# Altium schematic sheet SparkFun_STUSB4500_USB-PD.SchDoc: SparkFun_STUSB4500_USB-PD
size 270 x 224 mm; Origin: Eagle; Date: 12/02/2020 16:45:17; SheetNumber: 1; DESIGNER: DESIGNER; REV: REV; GateName_1: G$1; SymbolName_1: FRAME-LETTER; LibraryName: SparkFun-Aesthetics; DeviceSetName: FRAME-LETTER; GateName_2: V; SymbolName_2: DOCFIELD; Sheet: Sheet:; ReleasedundertheCreativeCommons: Released under the Creative Commons; AttributionShare-Alike4.0License: Attribution Share-Alike 4.0 License; https://creativecommons.org/licenses/by-sa/4.0/: https://creativecommons.org/licenses/by-sa/4.0/; Designby: Design by:
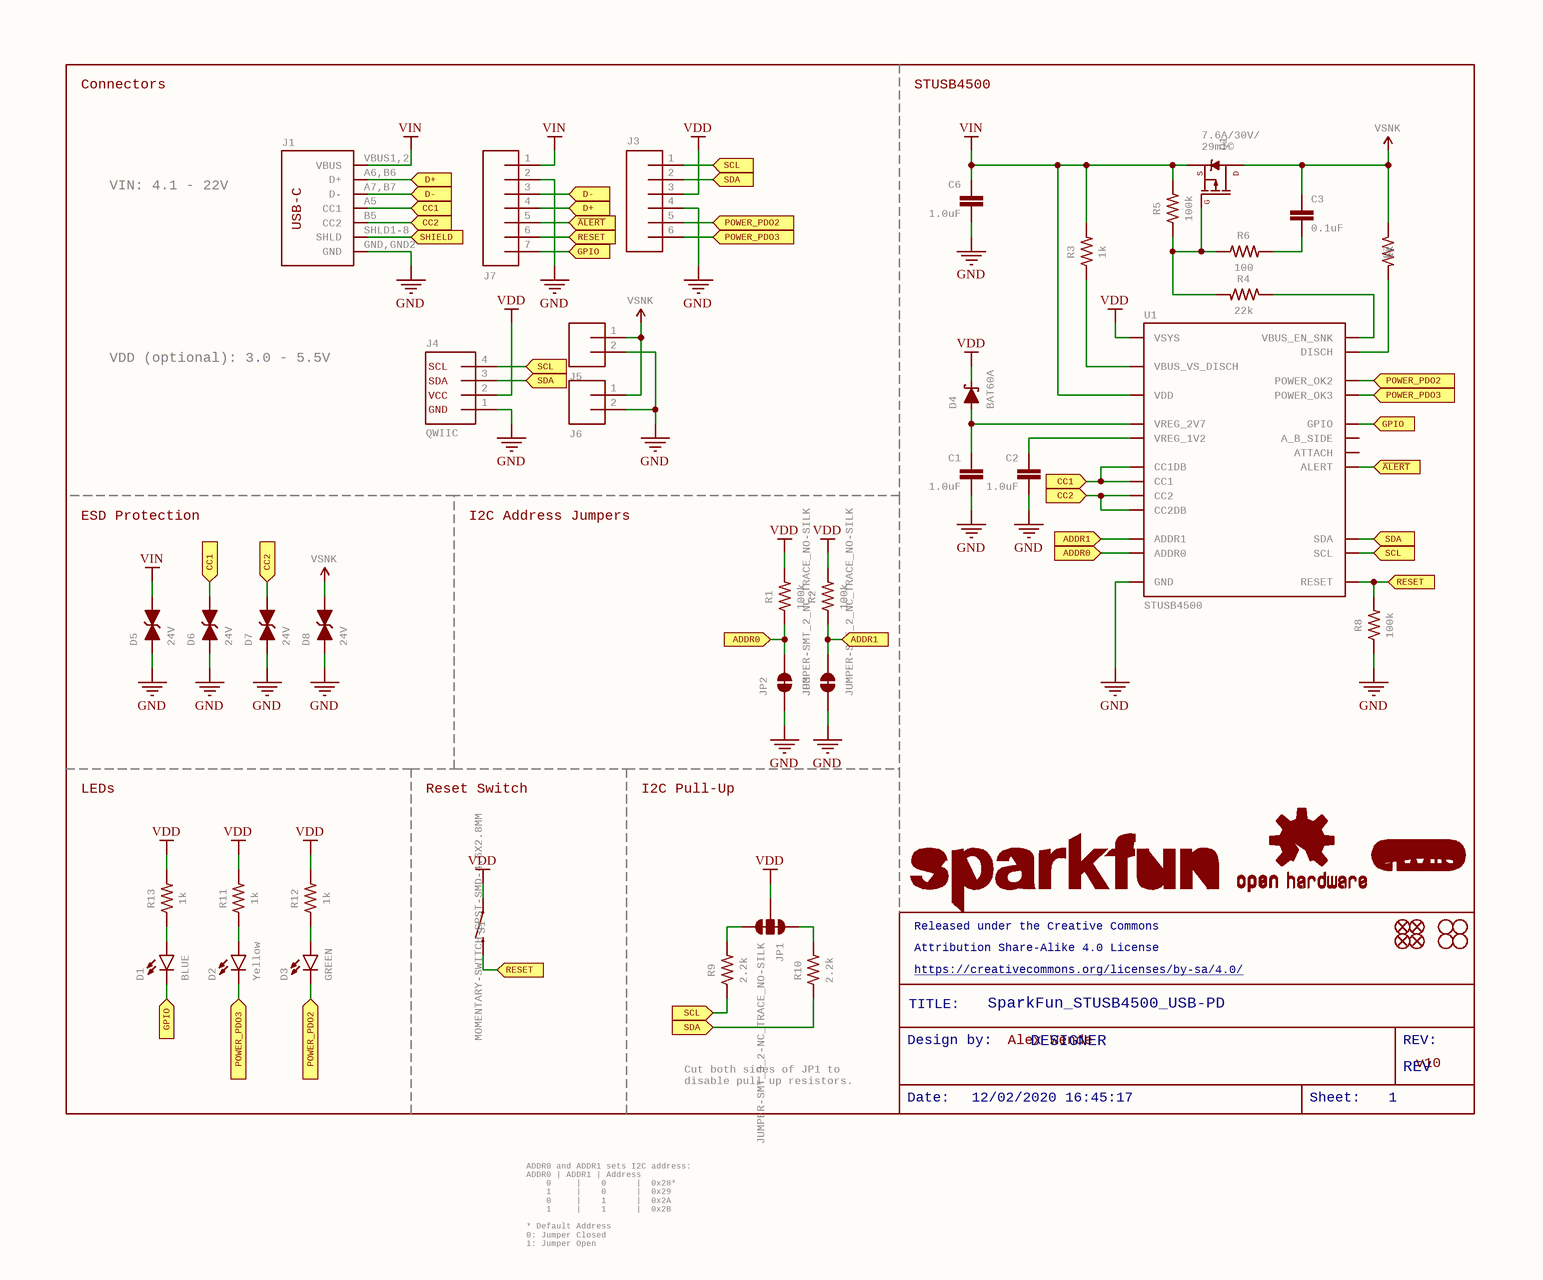
[diagram p0: SparkFun_STUSB4500_USB-PD.SchDoc]

## Parts
C1  1.0uF  [0603]
C2  1.0uF  [0603]
C3  0.1uF  [0603]
C6  1.0uF  [0603]
D1  BLUE  [LED-0603]
D2  Yellow  [LED-0603]
D3  GREEN  [LED-0603]
D4  BAT60A  [SOD-323]
D5  24V  [0603]
D6  24V  [0603]
D7  24V  [0603]
D8  24V  [0603]
FD1  FIDUCIALUFIDUCIAL  [FIDUCIAL-MICRO]  (value not drawn)
FD2  FIDUCIALUFIDUCIAL  [FIDUCIAL-MICRO]  (value not drawn)
FD3  FIDUCIALUFIDUCIAL  [FIDUCIAL-MICRO]  (value not drawn)
FD4  FIDUCIALUFIDUCIAL  [FIDUCIAL-MICRO]  (value not drawn)
H1  STAND-OFF  [STAND-OFF]  (value not drawn)
H2  STAND-OFF  [STAND-OFF]  (value not drawn)
H3  STAND-OFF  [STAND-OFF]  (value not drawn)
H4  STAND-OFF  [STAND-OFF]  (value not drawn)
J1  USB_C2-LAYER  [USB-C-16P]  (value not drawn)
J3  CONN_06NO_SILK_NO_POP  [1X06_NO_SILK]  (value not drawn)
J4  QWIIC  [JST04_1MM_RA]
J5  CONN_023.5MM  [SCREWTERMINAL-3.5MM-2]  (value not drawn)
J6  CONN_021X02_NO_SILK  [1X02_NO_SILK]  (value not drawn)
J7  CONN_07NO_SILK  [1X07_NO_SILK]  (value not drawn)
JP1  JUMPER-SMT_3_2-NC_TRACE_NO-SILK  [SMT-JUMPER_3_2-NC_TRACE_NO-SILK]
JP2  JUMPER-SMT_2_NC_TRACE_NO-SILK  [SMT-JUMPER_2_NC_TRACE_NO-SILK]
JP3  JUMPER-SMT_2_NC_TRACE_NO-SILK  [SMT-JUMPER_2_NC_TRACE_NO-SILK]
LOGO1  OSHW-LOGOS  [OSHW-LOGO-S]  (value not drawn)
LOGO2  SFE_LOGO_NAME.1_INCH  [SFE_LOGO_NAME_.1]  (value not drawn)
LOGO3  QWIIC_LOGO_5MM  [QWIIC_5MM]  (value not drawn)
Q1  9A/30V/15mΩ  [8-POWERVDFN-3X3]  (value not drawn)
R1  100k  [0603]
R2  100k  [0603]
R3  1k  [0603]
R4  22k  [0603]
R5  100k  [0603]
R6  100  [0603]
R7  1k  [0603]
R8  100k  [0603]
R9  2.2k  [0603]
R10  2.2k  [0603]
R11  1k  [0603]
R12  1k  [0603]
R13  1k  [0603]
S1  MOMENTARY-SWITCH-SPST-SMD-4.6X2.8MM  [TACTILE_SWITCH_SMD_4.6X2.8MM]
SUPPLY3  VSNK
SUPPLY4  VSNK
SUPPLY10  VSNK
U1  STUSB4500  [QFN-24]

## Ports
ADDR0 (in), ADDR1 (in), CC1 (in), CC2 (in), D+ (in), D- (in), GPIO (in), POWER_PDO2 (in), POWER_PDO3 (in), RESET (in), SCL (in), SDA (in), SHIELD (in), ~{ALERT} (in)

## Nets
GND: C1.2 C2.2 C6.2 D5.1(A) D6.1(A) D7.1(A) D8.1(A) J1.GND,GND2(GND) J3.4 J4.1 J5.2 J6.2 J7.2 JP2.1 JP3.1 R8.1 U1.P$10,25(GND)
VDD: D4.C J3.3 J4.2 JP1.2 R1.2 R2.2 R11.2 R12.2 R13.2 S1.1,2 U1.P$22(VSYS)
VIN: C6.1 D5.2(C) J1.VBUS1,2(VBUS) J7.1 Q1.1-3(S) R3.2 R5.2 U1.P$24(VDD)
~{ALERT}: J7.5 U1.P$19(ALERT) ; port ~{ALERT}
ADDR0: JP2.2 R1.1 U1.P$12(ADDR0) ; port ADDR0
ADDR1: JP3.2 R2.1 U1.P$13(ADDR1) ; port ADDR1
CC1: D6.2(C) J1.A5(CC1) U1.P$1(CC1DB) U1.P$2(CC1) ; port CC1
CC2: D7.2(C) J1.B5(CC2) U1.P$4(CC2) U1.P$5(CC2DB) ; port CC2
D+: J1.A6,B6(D+) J7.4 ; port D+
D-: J1.A7,B7(D-) J7.3 ; port D-
GPIO: D1.C J7.7 U1.P$15(GPIO) ; port GPIO
POWER_PDO2: D3.C J3.5 U1.P$20(POWER_OK2) ; port POWER_PDO2
POWER_PDO3: D2.C J3.6 U1.P$14(POWER_OK3) ; port POWER_PDO3
RESET: J7.6 R8.2 S1.3,4 U1.P$6(RESET) ; port RESET
SCL: J3.1 J4.4 R9.1 U1.P$7(SCL) ; port SCL
SDA: J3.2 J4.3 R10.1 U1.P$8(SDA) ; port SDA
SHIELD: J1.SHLD1-8(SHLD) ; port SHIELD
NetC1_1: C1.1 D4.A U1.P$23(VREG_2V7)
NetC2_1: C2.1 U1.P$21(VREG_1V2)
NetC3_1: C3.1 Q1.551-53(D) R7.1 SUPPLY4.?1(VOUT)
NetC3_2: C3.2 R6.2
NetD1_A: D1.A R13.1
NetD2_A: D2.A R11.1
NetD3_A: D3.A R12.1
NetD8_2: D8.2(C) SUPPLY3.?1(VOUT)
NetJ5_1: J5.1 J6.1 SUPPLY10.?1(VOUT)
NetJP1_1: JP1.1 R10.2
NetJP1_3: JP1.3 R9.2
NetQ1_4: Q1.4(G) R4.2 R5.1 R6.1
NetR3_1: R3.1 U1.P$18(VBUS_VS_DISCH)
NetR4_1: R4.1 U1.P$16(VBUS_EN_SNK)
NetR7_2: R7.2 U1.P$9(DISCH)

Not connected (* = marked no-connect by the designer): U1 P$11(ATTACH) P$17(A_B_SIDE)

## Notes on the sheet
- Connectors
- STUSB4500
- (near Q1) 7.6A/30V/
  29mÎ©
- VIN: 4.1 - 22V
- VDD (optional): 3.0 - 5.5V
- ESD Protection
- I2C Address Jumpers
- LEDs
- Reset Switch
- I2C Pull-Up
- (near LOGO2) Released under the Creative Commons
- TITLE:
- (near LOGO2) Attribution Share-Alike 4.0 License
- (near LOGO2) https://creativecommons.org/licenses/by-sa/4.0/
- SparkFun_STUSB4500_USB-PD
- Cut both sides of JP1 to
  disable pull up resistors.
- Design by:
- Alex Wende
- DESIGNER
- REV:
- REV
- v10
- Date:
- 12/02/2020 16:45:17
- Sheet:
- 1
- ADDR0 and ADDR1 sets I2C address:
  ADDR0 | ADDR1 | Address
  0     |    0      |  0x28*
  1     |    0      |  0x29
  0     |    1      |  0x2A
  1     |    1      |  0x2B
  * Default Address
  0: Jumper Closed
  1: Jumper Open

## Library data of the parts
C1 C2 C6 = 1.0UF-0603-16V-10%: 1ÂµF ceramic capacitors    A capacitor is a passive two-terminal electrical component used to store electrical energy temporarily in an electric field.; GateName_1: G$1; SymbolName_1: CAP; PROD_ID: CAP-00868; DeviceName: -0603-16V-10%; LibraryName: SparkFun-Capacitors; DeviceSetName: 1.0UF
C3 = 0.1UF-0603-100V-10%: 0.1ÂµF ceramic capacitors    A capacitor is a passive two-terminal electrical component used to store electrical energy temporarily in an electric field.; GateName_1: G$1; SymbolName_1: CAP; PROD_ID: CAP-08390; DeviceName: -0603-100V-10%; LibraryName: SparkFun-Capacitors; DeviceSetName: 0.1UF
D1 = LED-BLUE0603: Blue SMD LED    Used in manufacturing of various products at SparkFun   Packages: 0603 - SMD 0603 package [Product Link]  1206 - SMD1206  package [Product Link]    SparkFun Products: ESP8266 Thing-Dev Board  RedBoard; GateName_1: G$1; DeviceName: 0603; PROD_ID: DIO-08575; SymbolName_1: LED; LibraryName: SparkFun-LED; DeviceSetName: LED-BLUE
D2 = LED-YELLOW0603: Yellow SMD LED Used in manufacturing several products at SparkFun.    Packages:  0603 -  SMD 0603  package  0603 -SMART - SMART SMD 0603  package (more efficient/more expensive) [Product Link]   LilyPad - SMD1206  package[Product Datasheet]       SparkFun Products: Blynk Board  IOIO-OTG  XBee Explorer Serial; GateName_1: G$1; DeviceName: 0603; PROD_ID: DIO-09003; SymbolName_1: LED; LibraryName: SparkFun-LED; DeviceSetName: LED-YELLOW
D3 = LED-GREEN0603: Green SMD LED    Used in manufacturing of various products at SparkFun   Packages: 0603 - SMD 0603 package [Product Link]  LilyPad 1206 - SMD1206 LilyPad package [Product Link]   1206 - SMD1206  package   1206 Bottom Mount -SMD 1206 Bottom Mount    SparkFun Products: Pro Mini 328 -5V  RedBoard  MP3 Trigger  Makey Makey; GateName_1: G$1; DeviceName: 0603; PROD_ID: DIO-00821; SymbolName_1: LED; LibraryName: SparkFun-LED; DeviceSetName: LED-GREEN
D4 = DIODE-SCHOTTKY-BAT60A: Schottky diode    A Schottky diode is a semiconductor diode which has a low forward voltage drop and a very fast switching action.; GateName_1: G$1; PROD_ID: DIO-14072; SymbolName_1: DIODE-SCHOTTKY; DeviceName: -BAT60A; LibraryName: SparkFun-DiscreteSemi; DeviceSetName: DIODE-SCHOTTKY
D5-D8 = DIODE_TVS: GateName_1: G$1; SymbolName_1: DIODE-TVS; PROD_ID: DIO-14502; LibraryName: SparkFun-DiscreteSemi; DeviceSetName: DIODE_TVS
FD1-FD4 = FIDUCIALUFIDUCIAL: Fiducial Alignment Points    Point-of-reference for pick-and-place machines and other optical instruments.; GateName_1: G$1; SymbolName_1: FIDUCIAL; DeviceName: UFIDUCIAL; LibraryName: SparkFun-Aesthetics; DeviceSetName: FIDUCIAL
H1-H4 = STAND-OFF: Stand Off    Drill holes for mechanically mounting via screws, standoffs, etc.   Note: Use the keepout ring to avoid running the screw head into surrounding components.  Variant Overviews  STAND-OFF - Mechanical footprint for a #4 phillips button head screw.  STAND-OFF-TIGHT - Mechanical footprint for a #4 phillips button head screw,      Example SparkFun Products  Screw - Phillips Head (1/4", 4-40, 10 pack) (PRT-10453)  Screw - Phillips Head (1/2", 4-40, 10 pack) (PRT-10452)  Screw - Phillips Head (3/4", 4-40, 10 pack) (PRT-10451)  Screw - Phillips Head (1", 4-40, 10 pack) (PRT-10450); GateName_1: G$1; SymbolName_1: STAND-OFF; LibraryName: SparkFun-Hardware; DeviceSetName: STAND-OFF
J1 = USB_C2-LAYER: USB Type C 16Pin Connector Super Speed pins not available on the 16-pin purely SMD connector so this part is best for USB 2.0 implementations. D1 and D2 are tied together enabling D+/- no matter which way the cable is plugged into the connector. The two channel configuration pins (CC1/2) are exposed. These are normally connected to ground via 5.1k resistors but can be reconfigured for high current/high power applications.; GateName_1: J1; SymbolName_1: USB-C-MINIMUM; DeviceSetName: USB_C; PROD_ID: CONN-14122; DeviceName: 2-LAYER; LibraryName: SparkFun-Connectors; USB-C: USB-C
J3 = CONN_06NO_SILK_NO_POP: Multi connection point. Often used as Generic Header-pin footprint for 0.1 inch spaced/style header connections    On any of the 0.1 inch spaced packages, you can populate with these:  Break Away Headers - Straight (PRT-00116)   Break Away Male Headers - Right Angle (PRT-00553)   Female Headers (PRT-00115)   Break Away Headers - Machine Pin (PRT-00117)   Break Away Female Headers - Swiss Machine Pin (PRT-00743)   Arduino Stackable Header - 6 Pin (PRT-09280)        For SCREWTERMINALS and SPRING TERMINALS visit here:  Screw Terimnals on SparkFun.com (5mm/3.5mm/2.54mm spacing)       This device is also useful as a general connection point to wire up your design to another part of your project. Our various solder wires solder well into these plated through hole pads.  Hook-Up Wire - Assortment (Stranded, 22 AWG) (PRT-11375)   Hook-Up Wire - Assortment (Solid Core, 22 AWG) (PRT-11367)   View the entire wire category on our website here; GateName_1: G$1; SymbolName_1: CONN_06; DeviceName: NO_SILK_NO_POP; LibraryName: SparkFun-Connectors; DeviceSetName: CONN_06
J4 = QWIIC_CONNECTORJS-1MM: SparkFun I2C Standard Qwiic Connector An SMD 1mm pitch JST connector makes it easy and quick (get it? Qwiic?) to connect I2C devices to each other. The Qwiic system enables fast and solderless connection between popular platforms and various sensors and actuators.   We carry 200mm, 100mm, 50mm, and breadboard friendly Qwiic cables. We also offer 10 pcs strips the SMD connectors.; GateName_1: G$1; SymbolName_1: I2C_STANDARD; DeviceName: JS-1MM; PROD_ID: CONN-13694; LibraryName: SparkFun-Connectors; DeviceSetName: QWIIC_CONNECTOR; SDA: SDA; VCC: VCC; GND: GND; SCL: SCL
J5 = CONN_023.5MM: Multi connection point. Often used as Generic Header-pin footprint for 0.1 inch spaced/style header connections    On any of the 0.1 inch spaced packages, you can populate with these:  Break Away Headers - Straight (PRT-00116)   Break Away Male Headers - Right Angle (PRT-00553)   Female Headers (PRT-00115)   Break Away Headers - Machine Pin (PRT-00117)   Break Away Female Headers - Swiss Machine Pin (PRT-00743)        For SCREWTERMINALS and SPRING TERMINALS visit here:  Screw Terimnals on SparkFun.com (5mm/3.5mm/2.54mm spacing)       This device is also useful as a general connection point to wire up your design to another part of your project. Our various solder wires solder well into these plated through hole pads.  Hook-Up Wire - Assortment (Stranded, 22 AWG) (PRT-11375)   Hook-Up Wire - Assortment (Solid Core, 22 AWG) (PRT-11367)   View the entire wire category on our website here          Special notes: Molex polarized connector foot print use with: PRT-08233 with associated crimp pins and housings.  2.54_SCREWTERM for use with  PRT-10571.  3.5mm Screw Terminal footprints for  PRT-08084  5mm Screw Terminal footprints for use with PRT-08432; GateName_1: G$1; PROD_ID: CONN-08399; SymbolName_1: CONN_02; DeviceName: 3.5MM; LibraryName: SparkFun-Connectors; DeviceSetName: CONN_02
J6 = CONN_021X02_NO_SILK: Multi connection point. Often used as Generic Header-pin footprint for 0.1 inch spaced/style header connections    On any of the 0.1 inch spaced packages, you can populate with these:  Break Away Headers - Straight (PRT-00116)   Break Away Male Headers - Right Angle (PRT-00553)   Female Headers (PRT-00115)   Break Away Headers - Machine Pin (PRT-00117)   Break Away Female Headers - Swiss Machine Pin (PRT-00743)        For SCREWTERMINALS and SPRING TERMINALS visit here:  Screw Terimnals on SparkFun.com (5mm/3.5mm/2.54mm spacing)       This device is also useful as a general connection point to wire up your design to another part of your project. Our various solder wires solder well into these plated through hole pads.  Hook-Up Wire - Assortment (Stranded, 22 AWG) (PRT-11375)   Hook-Up Wire - Assortment (Solid Core, 22 AWG) (PRT-11367)   View the entire wire category on our website here          Special notes: Molex polarized connector foot print use with: PRT-08233 with associated crimp pins and housings.  2.54_SCREWTERM for use with  PRT-10571.  3.5mm Screw Terminal footprints for  PRT-08084  5mm Screw Terminal footprints for use with PRT-08432; GateName_1: G$1; SymbolName_1: CONN_02; DeviceName: 1X02_NO_SILK; LibraryName: SparkFun-Connectors; DeviceSetName: CONN_02
J7 = CONN_07NO_SILK: Multi connection point. Often used as Generic Header-pin footprint for 0.1 inch spaced/style header connections    On any of the 0.1 inch spaced packages, you can populate with these:  Break Away Headers - Straight (PRT-00116)   Break Away Male Headers - Right Angle (PRT-00553)   Female Headers (PRT-00115)   Break Away Headers - Machine Pin (PRT-00117)   Break Away Female Headers - Swiss Machine Pin (PRT-00743)        For SCREWTERMINALS and SPRING TERMINALS visit here:  Screw Terimnals on SparkFun.com (5mm/3.5mm/2.54mm spacing)       This device is also useful as a general connection point to wire up your design to another part of your project. Our various solder wires solder well into these plated through hole pads.  Hook-Up Wire - Assortment (Stranded, 22 AWG) (PRT-11375)   Hook-Up Wire - Assortment (Solid Core, 22 AWG) (PRT-11367)   View the entire wire category on our website here          Special notes:     Molex polarized connector foot print use with SKU : PRT-08231 with associated crimp pins and housings. 1MM SMD Version SKU: PRT-10208    NOTES ON THE VARIANTS LOCK and LOCK_LONGPADS... This footprint was designed to help hold the alignment of a through-hole component (i.e.  6-pin header) while soldering it into place. You may notice that each hole has been shifted either up or down by 0.005 of an inch from it's more standard position (which is a perfectly straight line).  This slight alteration caused the pins (the squares in the middle) to touch the edges of the holes.  Because they are alternating, it causes a "brace" to hold the component in place.  0.005 has proven to be the perfect amount of "off-center" position when using our standard breakaway headers. Although looks a little odd when you look at the bare footprint, once you have a header in there, the alteration is very hard to notice.  Also,if you push a header all the way into place, it is covered up entirely on the bottom side.; GateName_1: J1; SymbolName_1: CONN_07; DeviceName: NO_SILK; LibraryName: SparkFun-Connectors; DeviceSetName: CONN_07
JP1 = JUMPER-SMT_3_2-NC_TRACE_NO-SILK: Normally closed trace jumper (2 of 2 connections)    This jumper has a trace between all three pads so they are normally closed (NC). Use a razor knife to open the connection(s). For best results follow the IPC guidelines for cutting traces: Cutout at least 0.063 mm (0.005 in).  Remove all loose material to clean up the cut area.  Seal the cut with an approved epoxy.       Reapply solder to reclose the connection(s).; GateName_1: G$1; SymbolName_1: SMT-JUMPER_3_2-NC_TRACE; DeviceName: _NO-SILK; LibraryName: SparkFun-Jumpers; DeviceSetName: JUMPER-SMT_3_2-NC_TRACE
JP2 JP3 = JUMPER-SMT_2_NC_TRACE_NO-SILK: Normally closed trace jumper    This jumper has a trace between two pads so it's normally closed (NC). Use a razor knife to open the connection. For best results follow the IPC guidelines for cutting traces: Cutout at least 0.063 mm (0.005 in).  Remove all loose material to clean up the cut area.  Seal the cut with an approved epoxy.       Reapply solder to reclose the connection.; GateName_1: G$1; SymbolName_1: SMT-JUMPER_2_NC_TRACE; DeviceName: _NO-SILK; LibraryName: SparkFun-Jumpers; DeviceSetName: JUMPER-SMT_2_NC_TRACE
LOGO1 = OSHW-LOGOS: Open-Source Hardware (OSHW) Logo     This logo indicates the piece of hardware it is found on incorporates a OSHW license and/or adheres to the definition of open source hardware found here: http://freedomdefined.org/OSHW; GateName_1: G$1; DeviceName: S; SymbolName_1: OSHW-LOGO; LibraryName: SparkFun-Aesthetics; DeviceSetName: OSHW-LOGO
LOGO2 = SFE_LOGO_NAME.1_INCH: SparkFun Font Logo    This is the SparkFun name logo. The logo on the schematic will always be the same size; the package variant is the height of the flame part of the logo (or the height the flame would be, if it were drawn). Default layer for the logo on the board is tSilk.; GateName_1: G$1; SymbolName_1: SFE_LOGO_NAME; DeviceName: .1_INCH; LibraryName: SparkFun-Aesthetics; DeviceSetName: SFE_LOGO_NAME
LOGO3 = QWIIC_LOGO_5MM: Qwiic Logos for placement on schematic and PCB. The 5.5mm silk logo is best for placing next to Qwiic connector.; GateName_1: G$1; DeviceName: _5MM; SymbolName_1: LOGO; LibraryName: SparkFun-Aesthetics; DeviceSetName: QWIIC_LOGO
Q1 = MOSFET_PCH-STL9P3LLH6: P-channel MOSFETs    Voltage controlled devices that allow control of high current outputs.   SparkFun Products: SparkFun ESP32 Thing  SparkFun ESP8266 Thing  SparkFun Pi Servo HAT V2 DMG2305UX-7 (20V/4.2A/SOT23-3); GateName_1: G$1; SymbolName_1: LABELED-PMOS; PROD_ID: TRANS-14715; DeviceName: -STL9P3LLH6; LibraryName: SparkFun-DiscreteSemi; DeviceSetName: MOSFET_PCH; D: D; S: S; G: G
R1 R2 R5 R8 = 100KOHM-0603-1/10W-1%: 100kÎ© resistor    A resistor is a passive two-terminal electrical component that implements electrical resistance as a circuit element. Resistors act to reduce current flow, and, at the same time, act to lower voltage levels within circuits. - Wikipedia; GateName_1: G$1; PROD_ID: RES-07828; SymbolName_1: RESISTOR; DeviceName: -0603-1/10W-1%; LibraryName: SparkFun-Resistors; DeviceSetName: 100KOHM
R3 R7 R11-R13 = 1KOHM-0603-1/10W-1%: 1kÎ© resistor    A resistor is a passive two-terminal electrical component that implements electrical resistance as a circuit element. Resistors act to reduce current flow, and, at the same time, act to lower voltage levels within circuits. - Wikipedia; GateName_1: G$1; DeviceSetName: 1KOHM; PROD_ID: RES-07856; SymbolName_1: RESISTOR; DeviceName: -0603-1/10W-1%; LibraryName: SparkFun-Resistors
R4 = 22KOHM-0603-1/10W-1%: 22kÎ© resistor    A resistor is a passive two-terminal electrical component that implements electrical resistance as a circuit element. Resistors act to reduce current flow, and, at the same time, act to lower voltage levels within circuits. - Wikipedia; GateName_1: G$1; DeviceSetName: 22KOHM; PROD_ID: RES-07853; SymbolName_1: RESISTOR; DeviceName: -0603-1/10W-1%; LibraryName: SparkFun-Resistors
R6 = 100OHM-0603-1/10W-1%: 100Î© resistor    A resistor is a passive two-terminal electrical component that implements electrical resistance as a circuit element. Resistors act to reduce current flow, and, at the same time, act to lower voltage levels within circuits. - Wikipedia; GateName_1: G$1; DeviceSetName: 100OHM; PROD_ID: RES-07863; SymbolName_1: RESISTOR; DeviceName: -0603-1/10W-1%; LibraryName: SparkFun-Resistors
R9 R10 = 2.2KOHM-0603-1/10W-1%: 2.2kÎ© resistor    A resistor is a passive two-terminal electrical component that implements electrical resistance as a circuit element. Resistors act to reduce current flow, and, at the same time, act to lower voltage levels within circuits. - Wikipedia; GateName_1: G$1; PROD_ID: RES-08272; SymbolName_1: RESISTOR; DeviceName: -0603-1/10W-1%; LibraryName: SparkFun-Resistors; DeviceSetName: 2.2KOHM
S1 = MOMENTARY-SWITCH-SPST-SMD-4.6X2.8MM: Momentary Switch (Pushbutton) - SPST    Normally-open (NO) SPST momentary switches (buttons, pushbuttons). Variants  PTH-12MM - 12mm square, through-hole  Momentary Pushbutton Switch - 12mm Square (COM-09190)     PTH-6.0MM, PTH-6.0MM-KIT - 6.0mm square, through-hole  Mini Pushbutton Switch (COM-00097)  KIT package intended for soldering kit's - only one side of pads' copper is exposed.     PTH-RIGHT-ANGLE-KIT - Right-angle, through-hole  Right Angle Tactile Button - Used on SparkFun BigTime Watch Kit     SMD-12MM - 12mm square, surface-mount  Tactile Button - SMD (12mm) (COM-12993)  Used on SparkFun PicoBoard     SMD-4.5MM - 4.5mm Square Trackball Switch  Used on SparkFun Blackberry Trackballer Breakout     SMD-4.6MMX2.8MM -  4.60mm x 2.80mm, surface mount  Used on SparkFun SAMD21 Mini Breakout     SMD-5.2MM, SMD-5.2-REDUNDANT - 5.2mm square, surface-mount  Mini Pushbutton Switch - SMD (COM-08720)  Used on Arduino Pro Mini  REDUNDANT package connects both switch circuits together     SMD-6.0X3.5MM - 6.0 x 3.5mm, surface mount  Momentary Reset Switch SMD (COM-08229)     SMD-6.2MM-TALL - 6.2mm square, surface mount  Tactile Button - SMD (6mm)  Used on SparkFun Digital Sandbox     SMD-RIGHT-ANGLE - Right-angle, surface mount  Used on SparkFun Block for IntelÂ® Edison - Arduino; GateName_1: G$1; SymbolName_1: SWITCH-MOMENTARY-2; PROD_ID: SWCH-13065; DeviceName: -SMD-4.6X2.8MM; LibraryName: SparkFun-Switches; DeviceSetName: MOMENTARY-SWITCH-SPST
SUPPLY3 SUPPLY4 SUPPLY10 = VOUT: VOUT Voltage Output    Output voltage; GateName_1: G$1; SymbolName_1: VOUT; LibraryName: SparkFun-PowerSymbols; DeviceSetName: VOUT
U1 = STUSB4500: GateName_1: G$1; PROD_ID: IC-14684; SymbolName_1: STUSB4500; LibraryName: SparkFun-IC-Power; DeviceSetName: STUSB4500